# Altium schematic sheet Power Supply.SchDoc: Power Supply
size A4; Author: Robbie Smedts; DrawnBy: Robbie Smedts; Engineer: Robbie Smedts; Organization: Thomas More; DocumentNumber: 5; Revision: 1; SheetNumber: 5; SheetTotal: 5; DocumentName: Power Supply
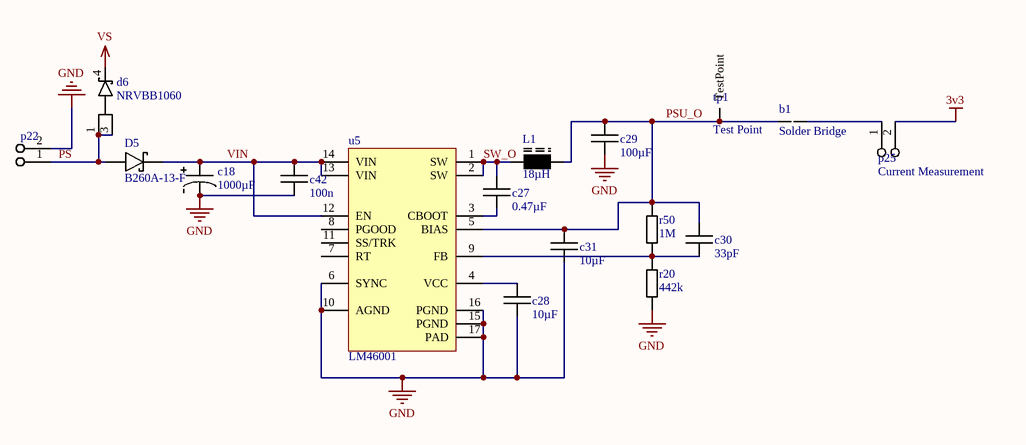
[diagram p0: Power Supply.SchDoc]

## Parts
b1  Solder Bridge  [Solder Bridge]
c18  1000µF  [TH Elco 16]
c27  0.47µF  [0805]
c28  10µF  [0603]
c29  100µF  [1210]
c30  33pF  [0603]
c31  10µF  [0603]
c42  100n  [0603]
D5  B260A-13-F  [DO-214AB (SMA)]
d6  NRVBB1060  [D²PAK 3]
L1  18µH  [SMD Inductor 7.4x7.4]
p22  MKDSN 1.5  [ScrewWtB-2]  (value not drawn)
p25  Current Measurement  [1x2-HeaderPin]
r20  442k  [0603]
r50  1M  [0603]
tp1  Test Point  [Test Point]
u5  LM46001  [PWP0016G]

## Nets
3v3: p25.2
GND: c18.1 c28.1 c29.1 c31.1 c42.1 p22.2 r20.1 u5.6(SYNC) u5.10(AGND) u5.15(PGND) u5.16(PGND) u5.17(PAD)
PGND: u5.16(PGND)
SW: u5.2(SW)
VIN: c18.2 c42.2 D5.1(Kathode) u5.12(EN) u5.13(VIN) u5.14(Vin)
VS: d6.4
PS: D5.2(Anode) d6.1 d6.3 p22.1
PSU_O: b1.1 c29.2 c30.2 c31.2 L1.2 r50.1 tp1.1(TestPoint) u5.5(BIAS)
SW_O: c27.2 L1.1 u5.1(SW) u5.2(SW)
Netb1_2: b1.2 p25.1
Netc27_1: c27.1 u5.3(CBOOT)
Netc28_2: c28.2 u5.4(VCC)
Netc30_1: c30.1 r20.2 r50.2 u5.9(FB)

Not connected (* = marked no-connect by the designer): u5 7(RT) 8(PGOOD) 11(SS/TRK)

## Notes on the sheet
- Title
- Size:
- Date:
- A4
- Number:
- Time:
- Revision:
- Sheet
- of
- File:

## Library data of the parts
c18 = Elco TH d16: d = 16mm
c27 = 0805 Capacitor: ...F
c28 c30 c31 c42 = 0603 Capacitor: ...F
c29 = 1210 Capacitor: C1210C107M8PACTU
D5 = B260A-13-F: Schottky Rectifier
d6 = NRVBB1060: Schottky Diode 10A
L1 = SRR0735A-180M: Shielded Power Inducor
p22 = MKDSN 1.5: Wire-to-board connection
p25 = 2 Pin Header
r20 r50 = 0603 Resistor: ...R